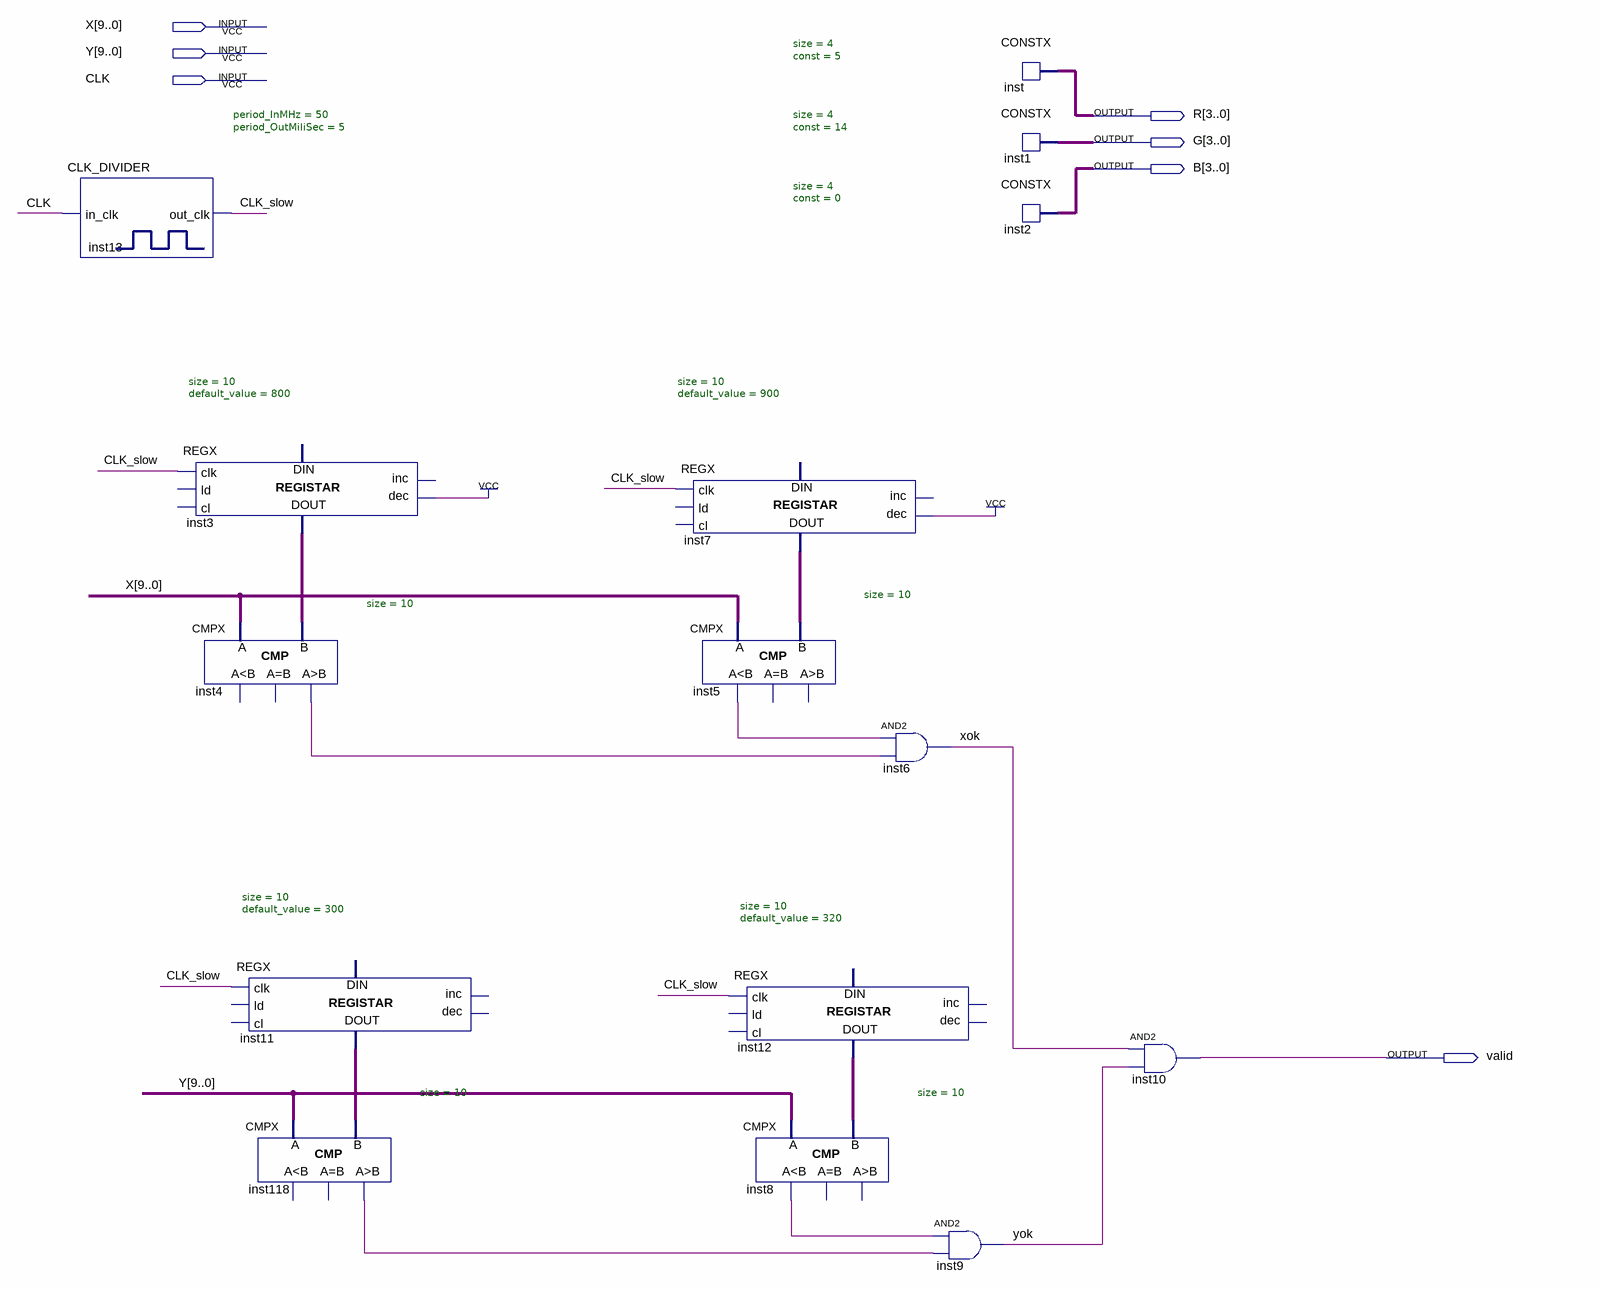
[diagram p0: schematic sheet]
// Quartus schematic zeleni_blok_3.bdf as structural Verilog: 15 symbols, 7 pins
module zeleni_blok_3 (
  input  [9:0] X,
  input  [9:0] Y,
  input  CLK,
  output [3:0] R,
  output [3:0] G,
  output [3:0] B,
  output valid
);

  wire CLK_slow, inst4_gr, inst5_ls, inst8_ls, inst118_gr, xok, yok;
  wire [9:0] inst3_data_out, inst7_data_out, inst11_data_out, inst12_data_out;

  CLK_DIVIDER #(.period_InMHz(50), .period_OutMiliSec(5)) inst13 (.in_clk(CLK), .out_clk(CLK_slow));
  REGX #(.size(10), .default_value(800)) inst3 (
    .clk(CLK_slow), .dec(1'b1), .data_out(inst3_data_out));  // open: ld, cl, inc, data_in
  CMPX #(.size(10)) inst4 (.A(X), .B(inst3_data_out), .gr(inst4_gr));  // open: ls, eq
  REGX #(.size(10), .default_value(300)) inst11 (
    .clk(CLK_slow), .data_out(inst11_data_out));  // open: ld, cl, inc, dec, data_in
  CMPX #(.size(10)) inst118 (.A(Y), .B(inst11_data_out), .gr(inst118_gr));  // open: ls, eq
  REGX #(.size(10), .default_value(900)) inst7 (
    .clk(CLK_slow), .dec(1'b1), .data_out(inst7_data_out));  // open: ld, cl, inc, data_in
  CMPX #(.size(10)) inst5 (.A(X), .B(inst7_data_out), .ls(inst5_ls));  // open: eq, gr
  REGX #(.size(10), .default_value(320)) inst12 (
    .clk(CLK_slow), .data_out(inst12_data_out));  // open: ld, cl, inc, dec, data_in
  CMPX #(.size(10)) inst8 (.A(Y), .B(inst12_data_out), .ls(inst8_ls));  // open: eq, gr
  and inst6 (xok, inst5_ls, inst4_gr);
  and inst9 (yok, inst8_ls, inst118_gr);
  CONSTX #(.size(4), .\const (5)) inst (.data(R));
  CONSTX #(.size(4), .\const (14)) inst1 (.data(G));
  CONSTX #(.size(4), .\const (0)) inst2 (.data(B));
  and inst10 (valid, xok, yok);
endmodule
